# Altium project fastic-userboard.PrjPcb
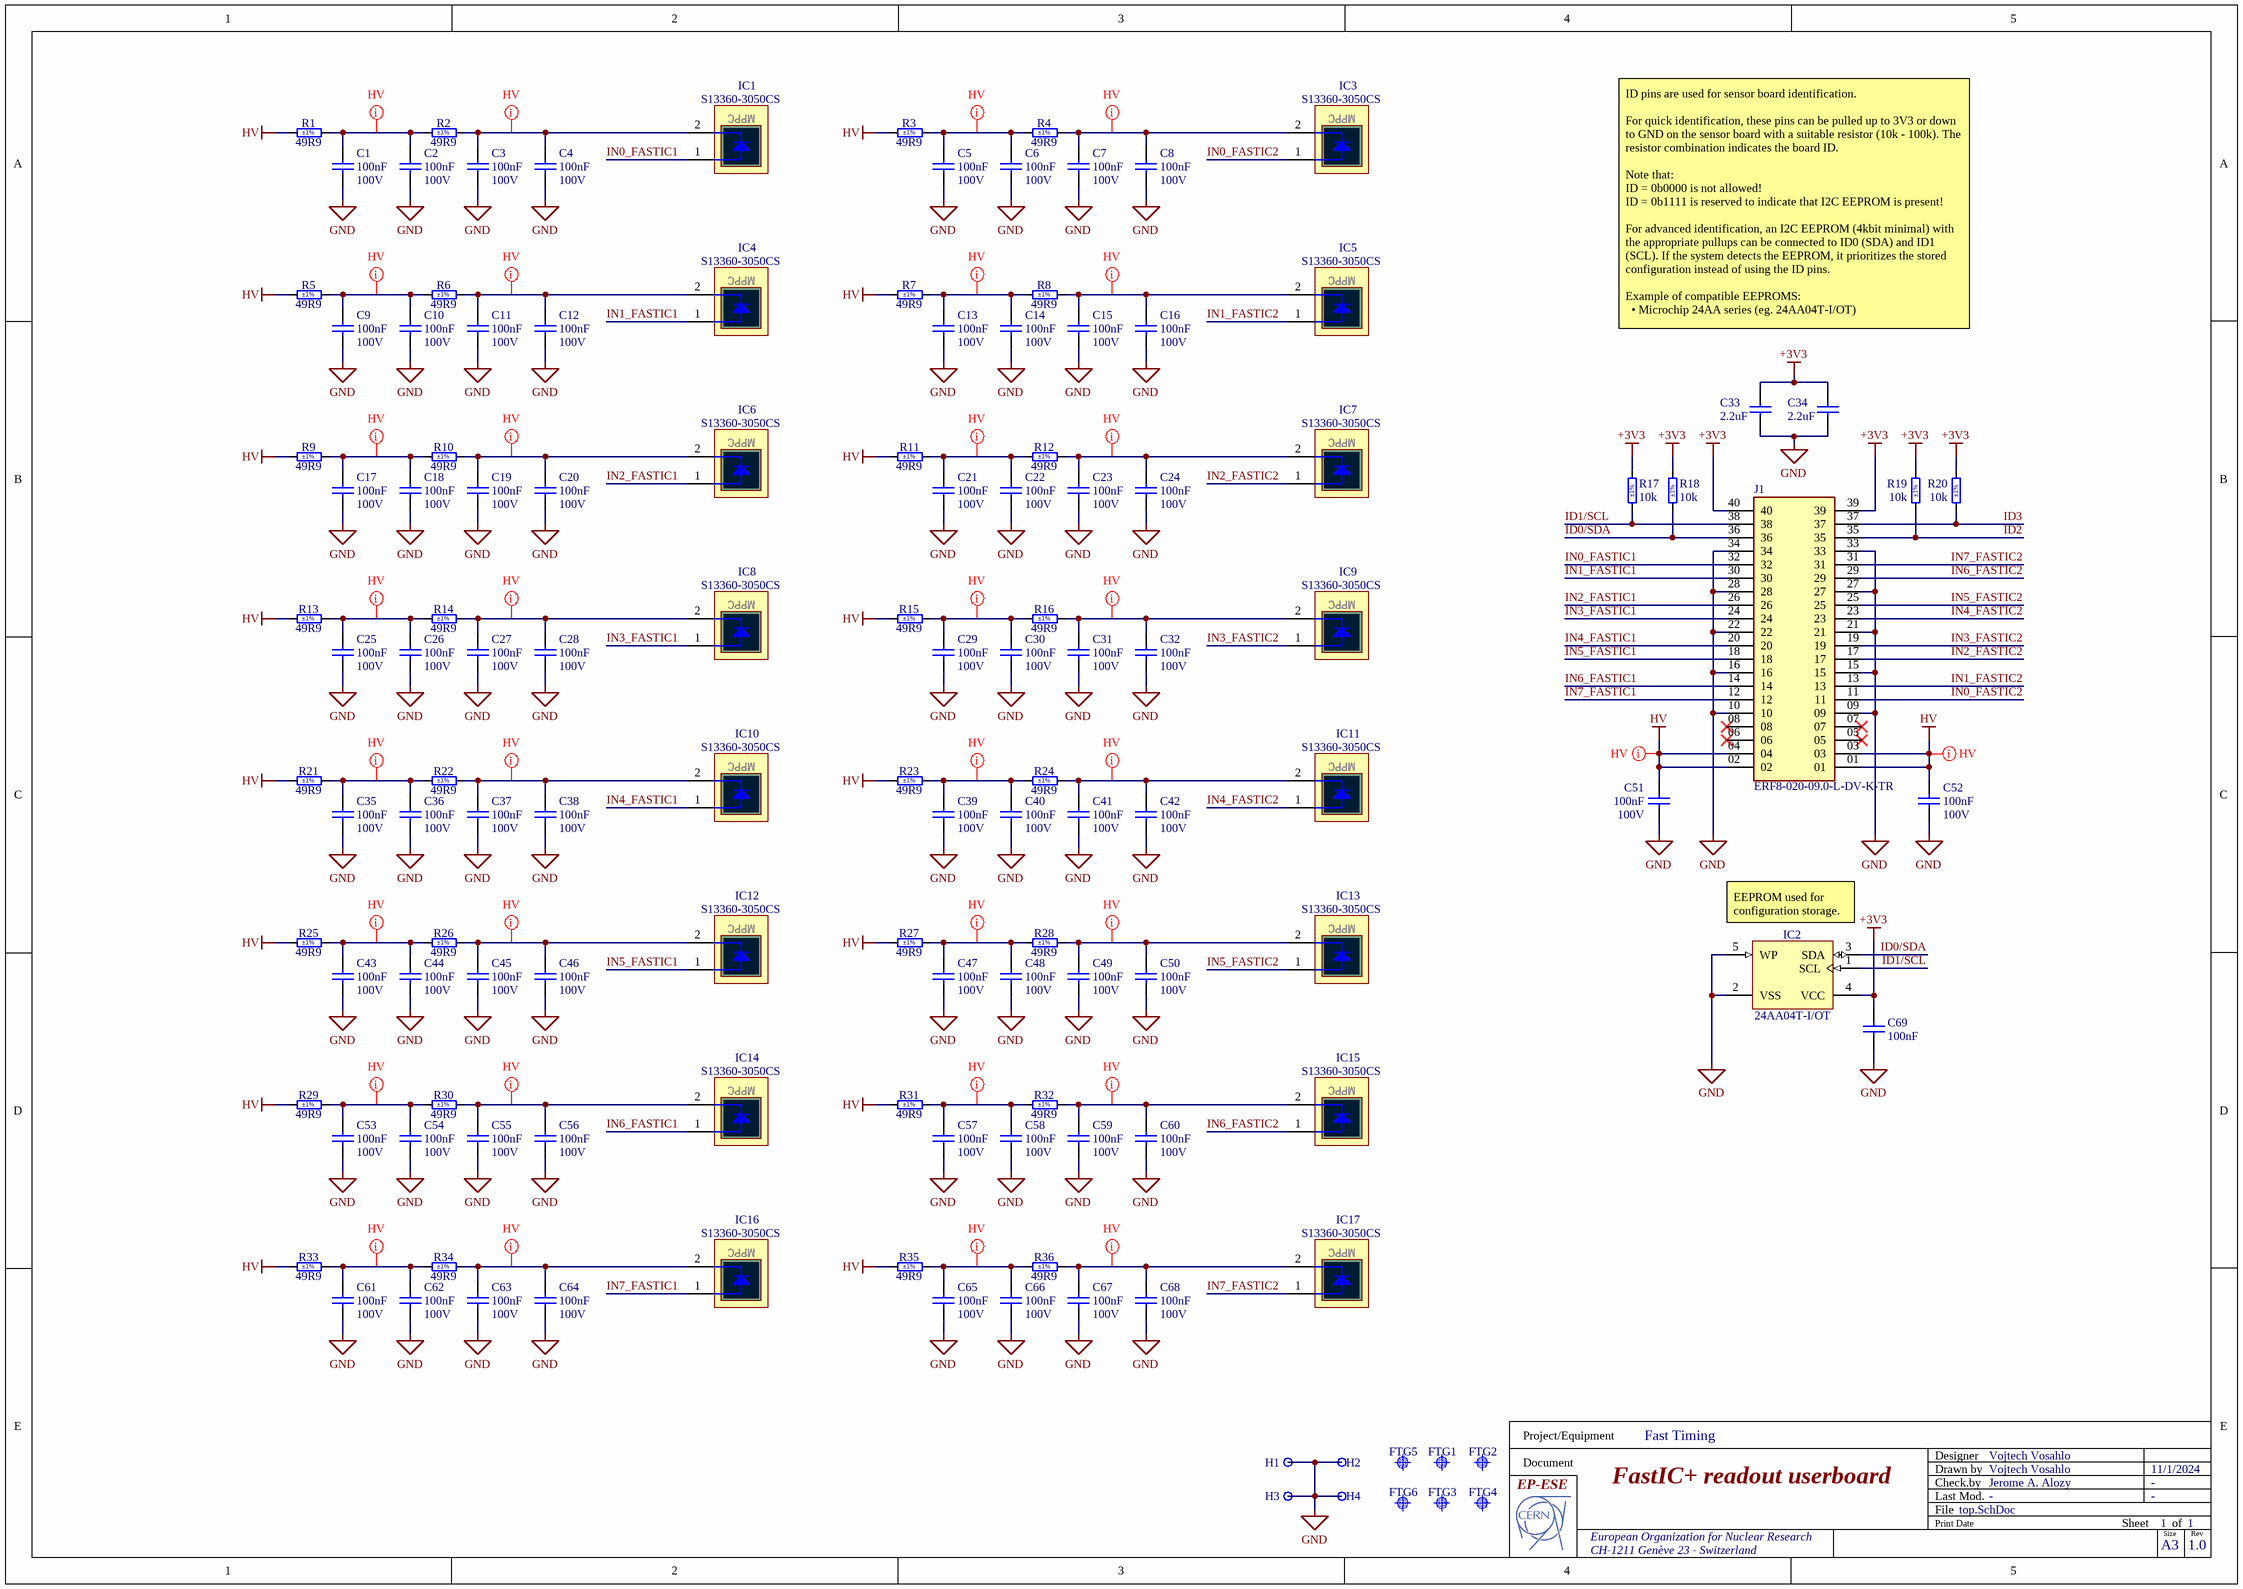
[diagram p0: top.SchDoc]
CheckedBy: Jerome A. Alozy; Designer: Vojtech Vosahlo; DivGrp: EP- ESE; DrawnBy: Vojtech Vosahlo; Projet: FastIC+ readout; revision: 1.0
1 sheet, 133 parts. Net scope: hierarchical (ports join the sheet entries above them; power ports are global).
Board files: fastic-userboard.PcbDoc, fastic-userboard_PANEL.PcbDoc

## Sheet top.SchDoc: FastIC+ readout userboard
size 420 x 297 mm; CheckedBy: Jerome A. Alozy; CompanyName: CERN; DrawnBy: Vojtech Vosahlo; Organization: CERN; Address1: European Organization for Nuclear Research; Address2: CH-1211 Genève 23 - Switzerland; Revision: 1.0; SheetNumber: 1; SheetTotal: 1; Projet: Fast Timing; ModifiedBy: -; CreateDate: 11/1/2024; CheckedDate: -; DivGrp: EP-ESE; Designer: Vojtech Vosahlo; ModifiedDate: -

### Parts
C1  100nF  Voltage: 100V  [CAPC1608X90N]
C2  100nF  Voltage: 100V  [CAPC1608X90N]
C3  100nF  Voltage: 100V  [CAPC1608X90N]
C4  100nF  Voltage: 100V  [CAPC1608X90N]
C5  100nF  Voltage: 100V  [CAPC1608X90N]
C6  100nF  Voltage: 100V  [CAPC1608X90N]
C7  100nF  Voltage: 100V  [CAPC1608X90N]
C8  100nF  Voltage: 100V  [CAPC1608X90N]
C9  100nF  Voltage: 100V  [CAPC1608X90N]
C10  100nF  Voltage: 100V  [CAPC1608X90N]
C11  100nF  Voltage: 100V  [CAPC1608X90N]
C12  100nF  Voltage: 100V  [CAPC1608X90N]
C13  100nF  Voltage: 100V  [CAPC1608X90N]
C14  100nF  Voltage: 100V  [CAPC1608X90N]
C15  100nF  Voltage: 100V  [CAPC1608X90N]
C16  100nF  Voltage: 100V  [CAPC1608X90N]
C17  100nF  Voltage: 100V  [CAPC1608X90N]
C18  100nF  Voltage: 100V  [CAPC1608X90N]
C19  100nF  Voltage: 100V  [CAPC1608X90N]
C20  100nF  Voltage: 100V  [CAPC1608X90N]
C21  100nF  Voltage: 100V  [CAPC1608X90N]
C22  100nF  Voltage: 100V  [CAPC1608X90N]
C23  100nF  Voltage: 100V  [CAPC1608X90N]
C24  100nF  Voltage: 100V  [CAPC1608X90N]
C25  100nF  Voltage: 100V  [CAPC1608X90N]
C26  100nF  Voltage: 100V  [CAPC1608X90N]
C27  100nF  Voltage: 100V  [CAPC1608X90N]
C28  100nF  Voltage: 100V  [CAPC1608X90N]
C29  100nF  Voltage: 100V  [CAPC1608X90N]
C30  100nF  Voltage: 100V  [CAPC1608X90N]
C31  100nF  Voltage: 100V  [CAPC1608X90N]
C32  100nF  Voltage: 100V  [CAPC1608X90N]
C33  2.2uF  [CAPC1608X90N]
C34  2.2uF  [CAPC1608X90N]
C35  100nF  Voltage: 100V  [CAPC1608X90N]
C36  100nF  Voltage: 100V  [CAPC1608X90N]
C37  100nF  Voltage: 100V  [CAPC1608X90N]
C38  100nF  Voltage: 100V  [CAPC1608X90N]
C39  100nF  Voltage: 100V  [CAPC1608X90N]
C40  100nF  Voltage: 100V  [CAPC1608X90N]
C41  100nF  Voltage: 100V  [CAPC1608X90N]
C42  100nF  Voltage: 100V  [CAPC1608X90N]
C43  100nF  Voltage: 100V  [CAPC1608X90N]
C44  100nF  Voltage: 100V  [CAPC1608X90N]
C45  100nF  Voltage: 100V  [CAPC1608X90N]
C46  100nF  Voltage: 100V  [CAPC1608X90N]
C47  100nF  Voltage: 100V  [CAPC1608X90N]
C48  100nF  Voltage: 100V  [CAPC1608X90N]
C49  100nF  Voltage: 100V  [CAPC1608X90N]
C50  100nF  Voltage: 100V  [CAPC1608X90N]
C51  100nF  Voltage: 100V  [CAPC1608X90N]
C52  100nF  Voltage: 100V  [CAPC1608X90N]
C53  100nF  Voltage: 100V  [CAPC1608X90N]
C54  100nF  Voltage: 100V  [CAPC1608X90N]
C55  100nF  Voltage: 100V  [CAPC1608X90N]
C56  100nF  Voltage: 100V  [CAPC1608X90N]
C57  100nF  Voltage: 100V  [CAPC1608X90N]
C58  100nF  Voltage: 100V  [CAPC1608X90N]
C59  100nF  Voltage: 100V  [CAPC1608X90N]
C60  100nF  Voltage: 100V  [CAPC1608X90N]
C61  100nF  Voltage: 100V  [CAPC1608X90N]
C62  100nF  Voltage: 100V  [CAPC1608X90N]
C63  100nF  Voltage: 100V  [CAPC1608X90N]
C64  100nF  Voltage: 100V  [CAPC1608X90N]
C65  100nF  Voltage: 100V  [CAPC1608X90N]
C66  100nF  Voltage: 100V  [CAPC1608X90N]
C67  100nF  Voltage: 100V  [CAPC1608X90N]
C68  100nF  Voltage: 100V  [CAPC1608X90N]
C69  100nF  [CAPC1608X90N]
FTG1  Use only in PCB  [FIDUCIAL_TOP_C100-200]  (value not drawn)
FTG2  Use only in PCB  [FIDUCIAL_TOP_C100-200]  (value not drawn)
FTG3  Use only in PCB  [FIDUCIAL_TOP_C100-200]  (value not drawn)
FTG4  Use only in PCB  [FIDUCIAL_TOP_C100-200]  (value not drawn)
FTG5  Use only in PCB  [FIDUCIAL_TOP_C100-200]  (value not drawn)
FTG6  Use only in PCB  [FIDUCIAL_TOP_C100-200]  (value not drawn)
H1  Plated Hole  [MTG240_400]  (value not drawn)  (no BOM)
H2  Plated Hole  [MTG240_400]  (value not drawn)  (no BOM)
H3  Plated Hole  [MTG240_400]  (value not drawn)  (no BOM)
H4  Plated Hole  [MTG240_400]  (value not drawn)  (no BOM)
IC1  S13360-3050CS  [HAMAMATSU_S13360-3050CS]
IC2  24AA04T-I/OT  [SOT95P280X145-5N]
IC3  S13360-3050CS  [HAMAMATSU_S13360-3050CS]
IC4  S13360-3050CS  [HAMAMATSU_S13360-3050CS]
IC5  S13360-3050CS  [HAMAMATSU_S13360-3050CS]
IC6  S13360-3050CS  [HAMAMATSU_S13360-3050CS]
IC7  S13360-3050CS  [HAMAMATSU_S13360-3050CS]
IC8  S13360-3050CS  [HAMAMATSU_S13360-3050CS]
IC9  S13360-3050CS  [HAMAMATSU_S13360-3050CS]
IC10  S13360-3050CS  [HAMAMATSU_S13360-3050CS]
IC11  S13360-3050CS  [HAMAMATSU_S13360-3050CS]
IC12  S13360-3050CS  [HAMAMATSU_S13360-3050CS]
IC13  S13360-3050CS  [HAMAMATSU_S13360-3050CS]
IC14  S13360-3050CS  [HAMAMATSU_S13360-3050CS]
IC15  S13360-3050CS  [HAMAMATSU_S13360-3050CS]
IC16  S13360-3050CS  [HAMAMATSU_S13360-3050CS]
IC17  S13360-3050CS  [HAMAMATSU_S13360-3050CS]
J1  ERF8-020-09.0-L-DV-K-TR  [SAMTEC_ERF8-020-09.0-L-DV-K-TR]
R1  49R9  Tolerance: ±1%  [RESC1608X55N]
R2  49R9  Tolerance: ±1%  [RESC1608X55N]
R3  49R9  Tolerance: ±1%  [RESC1608X55N]
R4  49R9  Tolerance: ±1%  [RESC1608X55N]
R5  49R9  Tolerance: ±1%  [RESC1608X55N]
R6  49R9  Tolerance: ±1%  [RESC1608X55N]
R7  49R9  Tolerance: ±1%  [RESC1608X55N]
R8  49R9  Tolerance: ±1%  [RESC1608X55N]
R9  49R9  Tolerance: ±1%  [RESC1608X55N]
R10  49R9  Tolerance: ±1%  [RESC1608X55N]
R11  49R9  Tolerance: ±1%  [RESC1608X55N]
R12  49R9  Tolerance: ±1%  [RESC1608X55N]
R13  49R9  Tolerance: ±1%  [RESC1608X55N]
R14  49R9  Tolerance: ±1%  [RESC1608X55N]
R15  49R9  Tolerance: ±1%  [RESC1608X55N]
R16  49R9  Tolerance: ±1%  [RESC1608X55N]
R17  10k  Tolerance: ±1%  [RESC1005X40N]
R18  10k  Tolerance: ±1%  [RESC1005X40N]
R19  10k  Tolerance: ±1%  [RESC1005X40N]
R20  10k  Tolerance: ±1%  [RESC1005X40N]
R21  49R9  Tolerance: ±1%  [RESC1608X55N]
R22  49R9  Tolerance: ±1%  [RESC1608X55N]
R23  49R9  Tolerance: ±1%  [RESC1608X55N]
R24  49R9  Tolerance: ±1%  [RESC1608X55N]
R25  49R9  Tolerance: ±1%  [RESC1608X55N]
R26  49R9  Tolerance: ±1%  [RESC1608X55N]
R27  49R9  Tolerance: ±1%  [RESC1608X55N]
R28  49R9  Tolerance: ±1%  [RESC1608X55N]
R29  49R9  Tolerance: ±1%  [RESC1608X55N]
R30  49R9  Tolerance: ±1%  [RESC1608X55N]
R31  49R9  Tolerance: ±1%  [RESC1608X55N]
R32  49R9  Tolerance: ±1%  [RESC1608X55N]
R33  49R9  Tolerance: ±1%  [RESC1608X55N]
R34  49R9  Tolerance: ±1%  [RESC1608X55N]
R35  49R9  Tolerance: ±1%  [RESC1608X55N]
R36  49R9  Tolerance: ±1%  [RESC1608X55N]

### Nets
+3V3: C33.1 C34.1 C69.2 IC2.4(VCC) J1.39 J1.40 R17.2 R18.2 R19.2 R20.2
GND: C1.1 C2.1 C3.1 C4.1 C5.1 C6.1 C7.1 C8.1 C9.1 C10.1 C11.1 C12.1 C13.1 C14.1 C15.1 C16.1 C17.1 C18.1 C19.1 C20.1 C21.1 C22.1 C23.1 C24.1 C25.1 C26.1 C27.1 C28.1 C29.1 C30.1 C31.1 C32.1 C33.2 C34.2 C35.1 C36.1 C37.1 C38.1 C39.1 C40.1 C41.1 C42.1 C43.1 C44.1 C45.1 C46.1 C47.1 C48.1 C49.1 C50.1 C51.1 C52.1 C53.1 C54.1 C55.1 C56.1 C57.1 C58.1 C59.1 C60.1 C61.1 C62.1 C63.1 C64.1 C65.1 C66.1 C67.1 C68.1 C69.1 H1.1 H2.1 H3.1 H4.1 IC2.2(VSS) IC2.5(WP) J1.09 J1.10 J1.15 J1.16 J1.21 J1.22 J1.27 J1.28 J1.33 J1.34
HV: C51.2 C52.2 J1.01 J1.02 J1.03 J1.04 R1.1 R3.1 R5.1 R7.1 R9.1 R11.1 R13.1 R15.1 R21.1 R23.1 R25.1 R27.1 R29.1 R31.1 R33.1 R35.1
ID0/SDA: IC2.3(SDA) J1.36 R18.1
ID1/SCL: IC2.1(SCL) J1.38 R17.1
ID2: J1.35 R19.1
ID3: J1.37 R20.1
IN0_FASTIC1: IC1.1(A) J1.32
IN0_FASTIC2: IC3.1(A) J1.11
IN1_FASTIC1: IC4.1(A) J1.30
IN1_FASTIC2: IC5.1(A) J1.13
IN2_FASTIC1: IC6.1(A) J1.26
IN2_FASTIC2: IC7.1(A) J1.17
IN3_FASTIC1: IC8.1(A) J1.24
IN3_FASTIC2: IC9.1(A) J1.19
IN4_FASTIC1: IC10.1(A) J1.20
IN4_FASTIC2: IC11.1(A) J1.23
IN5_FASTIC1: IC12.1(A) J1.18
IN5_FASTIC2: IC13.1(A) J1.25
IN6_FASTIC1: IC14.1(A) J1.14
IN6_FASTIC2: IC15.1(A) J1.29
IN7_FASTIC1: IC16.1(A) J1.12
IN7_FASTIC2: IC17.1(A) J1.31
NetC1_2: C1.2 C2.2 R1.2 R2.1
NetC3_2: C3.2 C4.2 IC1.2(C) R2.2
NetC5_2: C5.2 C6.2 R3.2 R4.1
NetC7_2: C7.2 C8.2 IC3.2(C) R4.2
NetC9_2: C9.2 C10.2 R5.2 R6.1
NetC11_2: C11.2 C12.2 IC4.2(C) R6.2
NetC13_2: C13.2 C14.2 R7.2 R8.1
NetC15_2: C15.2 C16.2 IC5.2(C) R8.2
NetC17_2: C17.2 C18.2 R9.2 R10.1
NetC19_2: C19.2 C20.2 IC6.2(C) R10.2
NetC21_2: C21.2 C22.2 R11.2 R12.1
NetC23_2: C23.2 C24.2 IC7.2(C) R12.2
NetC25_2: C25.2 C26.2 R13.2 R14.1
NetC27_2: C27.2 C28.2 IC8.2(C) R14.2
NetC29_2: C29.2 C30.2 R15.2 R16.1
NetC31_2: C31.2 C32.2 IC9.2(C) R16.2
NetC35_2: C35.2 C36.2 R21.2 R22.1
NetC37_2: C37.2 C38.2 IC10.2(C) R22.2
NetC39_2: C39.2 C40.2 R23.2 R24.1
NetC41_2: C41.2 C42.2 IC11.2(C) R24.2
NetC43_2: C43.2 C44.2 R25.2 R26.1
NetC45_2: C45.2 C46.2 IC12.2(C) R26.2
NetC47_2: C47.2 C48.2 R27.2 R28.1
NetC49_2: C49.2 C50.2 IC13.2(C) R28.2
NetC53_2: C53.2 C54.2 R29.2 R30.1
NetC55_2: C55.2 C56.2 IC14.2(C) R30.2
NetC57_2: C57.2 C58.2 R31.2 R32.1
NetC59_2: C59.2 C60.2 IC15.2(C) R32.2
NetC61_2: C61.2 C62.2 R33.2 R34.1
NetC63_2: C63.2 C64.2 IC16.2(C) R34.2
NetC65_2: C65.2 C66.2 R35.2 R36.1
NetC67_2: C67.2 C68.2 IC17.2(C) R36.2

Not connected (* = marked no-connect by the designer): J1 05* 06* 07* 08*

### Layout directives
net class HV: HV, NetC1_2, NetC3_2, NetC5_2, NetC7_2, NetC9_2, NetC11_2, NetC13_2, NetC15_2, NetC17_2, NetC19_2, NetC21_2, NetC23_2, NetC25_2, NetC27_2, NetC29_2, NetC31_2, NetC35_2, NetC37_2, NetC39_2, NetC41_2, NetC43_2, NetC45_2, NetC47_2, NetC49_2, NetC53_2, NetC55_2, NetC57_2, NetC59_2, NetC61_2, NetC63_2, NetC65_2, NetC67_2

### Notes on the sheet
- ID pins are used for sensor board identification.
  For quick identification, these pins can be pulled up to 3V3 or down to GND on the sensor board with a suitable resistor (10k - 100k). The resistor combination indicates the board ID.
  Note that:
  ID = 0b0000 is not allowed!
  ID = 0b1111 is reserved to indicate that I2C EEPROM is present!
  For advanced identification, an I2C EEPROM (4kbit minimal) with the appropriate pullups can be connected to ID0 (SDA) and ID1 (SCL). If the system detects the EEPROM, it prioritizes the stored configuration instead of using the ID pins.
  Example of compatible EEPROMS:
  • Microchip 24AA series (eg. 24AA04T-I/OT)
- (near IC2) EEPROM used for configuration storage.
- Project/Equipment
- Document
- Designer
- Drawn by
- Check.by
- File
- Last Mod.
- Print Date
- Sheet
- Size
- A3
- of
- Rev
- (in symbol S13360-3050CS) MPPC

### Library data of the parts
C1-C32 C35-C68 = CC0603_100NF_100V_10%_X7R: Non-polarised capacitor; Part Description: SMD Multilayer Chip Ceramic Capacitor; Manufacturer: GENERIC; Manufacturer1 Part Number: GRM188R72A104KA35D; TC: X7R; Tolerance: ±10%; Part Number: CC0603_100NF_100V_10%_X7R; Component Kind: Standard; Component Type: Standard; Pin Count: 2; Value: 100nF; Status: None; Manufacturer Part Number: CC0603_100NF_100V_10%_X7R; Case: 0603; Mounted: Yes; Socket: No; SMD: Yes; Sense: No; Manufacturer1 Example: MURATA; Manufacturer1 ComponentHeight: 0.9mm; HelpURL: \\cern.ch\dfs\Applications\Altium\Datasheets\CC0603_MURATA_GRM188R72A104KA35D.pdf; Author: CERN DEM JLC; CreateDate: 12/11/2013; LatestRevisionDate: 12/11/2013
C33 C34 = CC0603_2.2UF_10V_20%_X7R: Non-polarised capacitor; Part Description: SMD Multilayer Chip Ceramic Capacitor; Manufacturer: GENERIC; Manufacturer1 Part Number: LMK107B7225MA-T; Voltage: 10V; TC: X7R; Tolerance: ±20%; Part Number: CC0603_2.2UF_10V_20%_X7R; Component Kind: Standard; Component Type: Standard; Pin Count: 2; Value: 2.2uF; Status: Not Recommended; Manufacturer Part Number: CC0603_2.2UF_10V_20%_X7R; Case: 0603; Mounted: Yes; Socket: No; SMD: Yes; Sense: No; Manufacturer1 Example: TAIYO YUDEN; Manufacturer1 ComponentHeight: 0.9mm; HelpURL: \\cern.ch\dfs\Applications\Altium\Datasheets\CC0603_X7R_TAIYO-YUDEN_HIGH-VALUE.pdf; Author: CERN DEM JLC; CreateDate: 6/22/2011; LatestRevisionDate: 6/27/2011
C69 = CC0603_100NF_100V_10%_X7R: Non-polarised capacitor; Part Description: SMD Multilayer Chip Ceramic Capacitor; Manufacturer: GENERIC; Manufacturer1 Part Number: GRM188R72A104KA35D; Voltage: 100V; TC: X7R; Tolerance: ±10%; Part Number: CC0603_100NF_100V_10%_X7R; Component Kind: Standard; Component Type: Standard; Pin Count: 2; Value: 100nF; Status: None; Manufacturer Part Number: CC0603_100NF_100V_10%_X7R; Case: 0603; Mounted: Yes; Socket: No; SMD: Yes; Sense: No; Manufacturer1 Example: MURATA; Manufacturer1 ComponentHeight: 0.9mm; HelpURL: \\cern.ch\dfs\Applications\Altium\Datasheets\CC0603_MURATA_GRM188R72A104KA35D.pdf; Author: CERN DEM JLC; CreateDate: 12/11/2013; LatestRevisionDate: 12/11/2013
FTG1-FTG6 = FIDUCIAL_TARGET_C100-200: Fiducial Target; Part Description: Round Fiducial Target, Top Layer, 1.0mm, Top Solder 2.0mm, Keepout =2.0mm; Mounted: No; Part Number: FIDUCIAL_TARGET_C100-200; Component Kind: Standard (No BOM); Component Type: Standard (No BOM); Pin Count: 1; Family: Fiducial; Socket: No; SMD: Yes; Sense: No; Status: None; ComponentHeight: 0mm; HelpURL: Undefined; Author: CERN DEM JLC; CreateDate: 09/02/2010; LatestRevisionDate: 04/04/2012; PackageDescription: Round Fiducial Target, Top Layer, 1.0mm, Top Solder 2.0mm, Keepout =2.0mm
H1-H4 = PLATED_HOLE2.4_PAD4.0: Single Terminal Socket; Part Description: Plated Through Hole: Hole Dia.=2.4mm Pad Dia.=4.0mm; Mounted: No; Part Number: PLATED_HOLE2.4_PAD4.0; Component Type: Standard (No BOM); Pin Count: 1; Family: Plated Hole; Socket: No; SMD: No; Sense: No; Status: None; ComponentHeight: 0mm; HelpURL: Undefined; Author: CERN DEM JMW; CreateDate: 10/10/2011; LatestRevisionDate: 10/10/2011; PackageDescription: Plated Through Hole: Hole Dia.=2.4mm Pad Dia.=4.0mm
IC1 IC3-IC17 = S13360-3050CS: Single Element MPPC (Multi-Pixel Photon Counter); Part Description: 3x3mm, 3584 Pixels, Single Element MPPC (Multi-Pixel Photon Counter); Manufacturer: HAMAMATSU; PressFit: No; Sense Comment: Soldering Limitation and Cleaning Limitation; Bonding: No; Part Number: S13360-3050CS; Component Kind: Standard; Component Type: Standard; Device: S13360-3050CS; PackageDescription: 3x3mm, Single Element MPPC (Multi-Pixel Photon Counter), Body 6.55 x 6.90 x 2.00mm; Manufacturer Part Number: S13360-3050CS; Pin Count: 2; Mounted: Yes; Socket: No; SMD: No; Sense: Yes; ComponentHeight: 2.2mm; HelpURL: \\cern.ch\dfs\Applications\Altium\Datasheets\S13360-3050CS.pdf; Author: CERN DEM BC; CreateDate: 27/05/2020; LatestRevisionDate: 27/05/2020
IC2 = 24AA16T-E/OT: 1.7V-5.5V, 16K I2C Serial EEPROM; Part Description: 1.7V-5.5V, 16K I2C Serial EEPROM, Temperature Range -40°C to 125°C; Manufacturer: MICROCHIP TECHNOLOGY; PressFit: No; Bonding: No; Part Number: 24AA04T-I/OT; Component Kind: Standard; Component Type: Standard; Device: 24AA04T-I/OT; PackageDescription: SOT, 0.95mm Pitch; 5 Pin, 1.60mm W X 2.90mm L X 1.45mm H body, IPC Medium Density; Manufacturer Part Number: 24AA16T-E/OT; Pin Count: 5; Case: SOT23-5; Mounted: Yes; Socket: No; SMD: Yes; Sense: No; ComponentHeight: 1.45mm; HelpURL: \\cern.ch\dfs\Applications\Altium\Datasheets\24AA16T-E-OT.pdf; Author: CERN DEM BC; CreateDate: 11/5/2020; LatestRevisionDate: 11/5/2020
R1-R16 R21-R36 = R0603_49R9_1%_0.1W_100PPM: Resistor - 1%; Part Description: General Purpose Thick Film Chip Resistor; Manufacturer: GENERIC; Manufacturer1 Part Number: RC0603FR-0749R9L; Power: 0.1W; TC: ±100ppm/°C; PressFit: No; Part Number: R0603_49R9_1%_0.1W_100PPM; Component Kind: Standard; Component Type: Standard; Pin Count: 2; Value: 49R9; Status: Preferred; Manufacturer Part Number: R0603_49R9_1%_0.1W_100PPM; Case: 0603; Mounted: Yes; Sense: No; Socket: No; SMD: Yes; Manufacturer1 Example: YAGEO PHYCOMP; Manufacturer1 ComponentHeight: 0.55mm; HelpURL: \\cern.ch\dfs\Applications\Altium\Datasheets\R0603_PHYCOMP_RC0603.pdf; Author: CERN DEM JLC; CreateDate: 11/21/2017; LatestRevisionDate: 11/21/2017
R17-R20 = R0402_10K_1%_0.0625W_100PPM: Resistor - 1%; Part Description: General Purpose Thick Film Chip Resistor; Manufacturer: GENERIC; Manufacturer1 Part Number: 232270671003L; TC: ±100ppm/°C; PressFit: No; Part Number: R0402_10K_1%_0.0625W_100PPM; Component Kind: Standard; Component Type: Standard; Pin Count: 2; Value: 10k; Status: Not Recommended; Power: 0.0625W; Manufacturer Part Number: R0402_10K_1%_0.0625W_100PPM; Case: 0402; Mounted: Yes; Sense: No; Socket: No; SMD: Yes; Manufacturer1 Example: YAGEO PHYCOMP; Manufacturer1 ComponentHeight: 0.4mm; HelpURL: \\cern.ch\dfs\Applications\Altium\Datasheets\R0402_Phycomp_RC0402.pdf; Author: CERN DEM JLC; CreateDate: 12/3/2007; LatestRevisionDate: 10/17/2012
J1 = ERF8-020-09.0-L-DV-K-TR: Price: None; Value: *; Availability: Unavailable; Package: None; MP: ERF8-020-09.0-L-DV-K-TR

## Assembly variants
fastic-userboard: not fitted FTG1 FTG2 FTG3 FTG4 FTG5 FTG6 H1 H2 H3 H4 IC1 IC3 IC4 IC5 IC6 IC7 IC8 IC9 IC10 IC11 IC12 IC13 IC14 IC15 IC16 IC17